# Altium schematic sheet MCU.SchDoc: Peso
size A4; ApprovedBy: Adolfo de Souza Serique; CheckedBy: Adolfo de Souza Serique; Author: Adolfo de Souza Serique; CompanyName: Agym; DrawnBy: Adolfo de Souza Serique; Engineer: Adolfo de Souza Serique; DocumentNumber: 1; Revision: 1; SheetNumber: 2; SheetTotal: 2; Size: A4
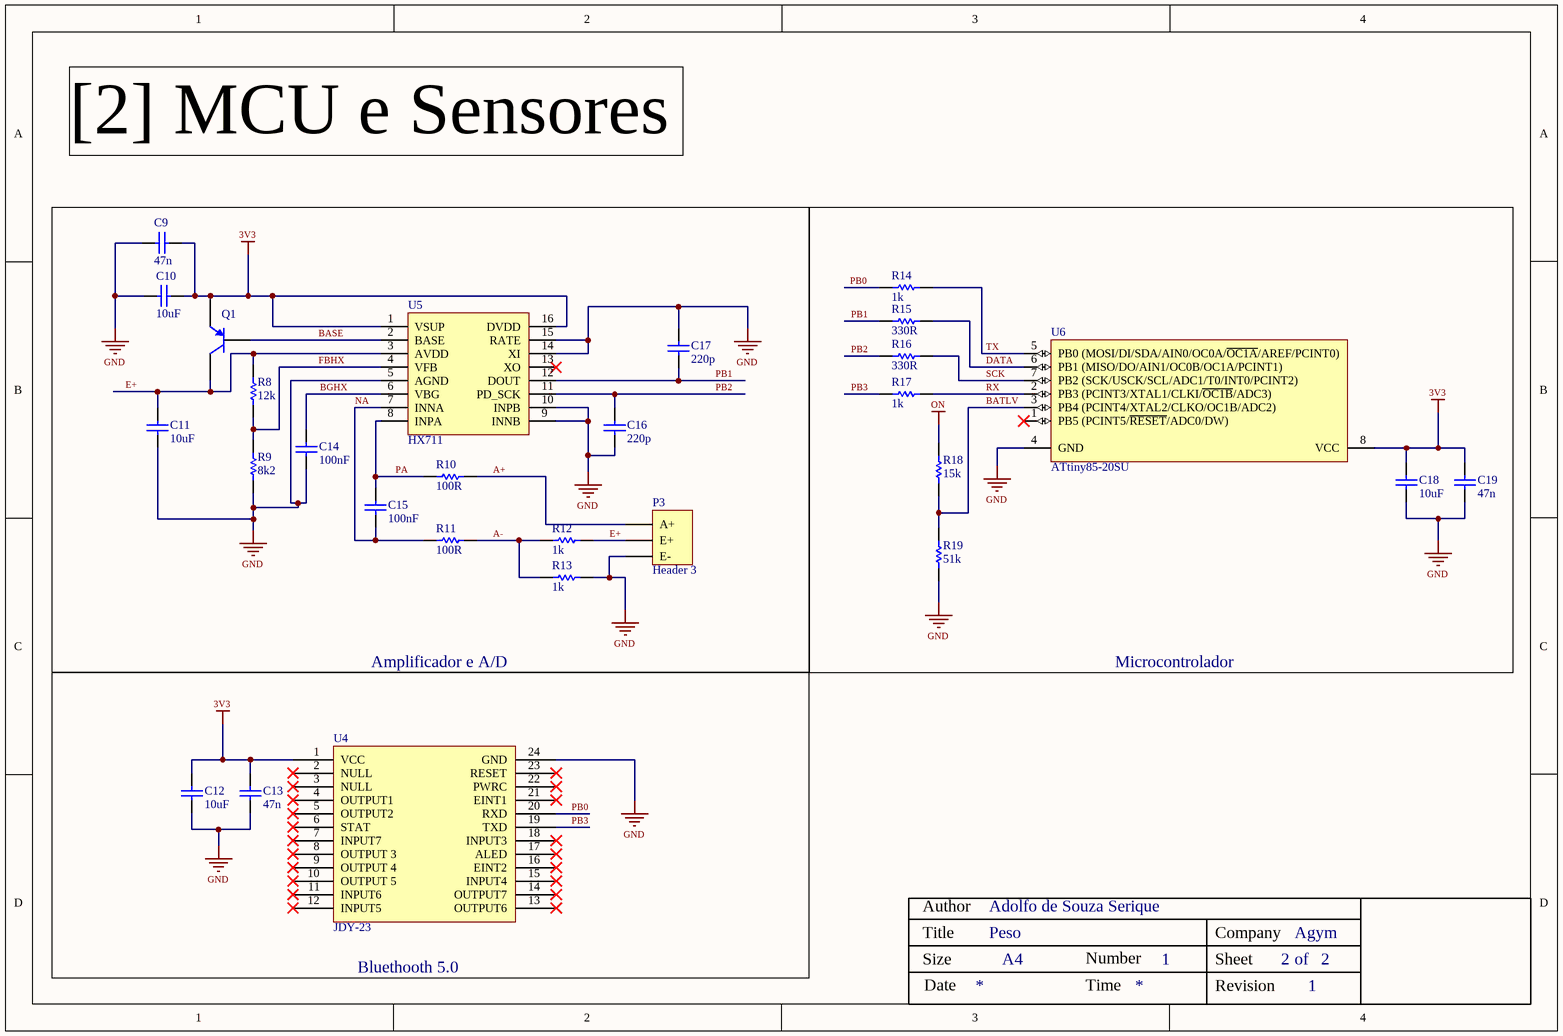
[diagram p0: MCU.SchDoc]

## Parts
C9  47n  [C1608[0603]]
C10  10uF  [C1608[0603]]
C11  10uF  [C1608[0603]]
C12  10uF  [C1608[0603]]
C13  47n  [C1608[0603]]
C14  100nF  [C1608[0603]]
C15  100nF  [C1608[0603]]
C16  220p  [C1005[0402]]
C17  220p  [C1005[0402]]
C18  10uF  [C1608[0603]]
C19  47n  [C1608[0603]]
P3  Header 3  [HDR1X3]
Q1  PNP  [SOT-23-3]  (value not drawn)
R8  12k  [R1608[0603]]
R9  8k2  [R1608[0603]]
R10  100R  [R1608[0603]]
R11  100R  [R1608[0603]]
R12  1k  [R1608[0603]]
R13  1k  [R1608[0603]]
R14  1k  [R1608[0603]]
R15  330R  [R1608[0603]]
R16  330R  [R1608[0603]]
R17  1k  [R1608[0603]]
R18  15k  [R1608[0603]]
R19  51k  [R1608[0603]]
U4  JDY-23  [JDY]
U5  HX711  [SOP-16-150mil]
U6  ATtiny85-20SU  [8S2_L]

## Blocks framed on the sheet
Microcontrolador: C18 C19 R14-R19 U6

## Nets
3V3: C9.2 C10.2 C12.1 C13.2 C18.1 C19.2 Q1.2(E) U4.1(VCC) U5.1(VSUP) U5.16(DVDD) U6.8(VCC)
GND: C9.1 C10.1 C11.1 C12.2 C13.1 C14.1 C16.1 C17.2 C18.2 C19.1 P3.2(E-) R9.1 R13.1 R19.1 U4.24(GND) U5.5(AGND) U5.9(INNB) U5.10(INPB) U5.14(XI) U5.15(RATE) U6.4(GND)
ON: R18.2
A+: P3.3(A+) R10.2
A-: R11.2 R12.1 R13.2
BASE: Q1.1(B) U5.2(BASE)
BATLV: R18.1 R19.2 U6.3(PB4_(PCINT4/XTAL2/CLKO/OC1B/ADC2))
BGHX: C14.2 U5.6(VBG)
DATA: R15.2 U6.6(PB1_(MISO/DO/AIN1/OC0B/OC1A/PCINT1))
E+: C11.2 P3.1(E+) Q1.3(C) R8.2 R12.2 U5.3(AVDD)
FBHX: R8.1 R9.2 U5.4(VFB)
NA: C15.1 R11.1 U5.7(INNA)
PA: C15.2 R10.1 U5.8(INPA)
PB0: R14.1 U4.20(RXD)
PB1: C17.1 R15.1 U5.12(DOUT)
PB2: C16.2 R16.1 U5.11(PD_SCK)
PB3: R17.1 U4.19(TXD)
RX: R17.2 U6.2(PB3_(PCINT3/XTAL1/CLKI/~{OC1B}/ADC3))
SCK: R16.2 U6.7(PB2_(SCK/USCK/SCL/ADC1/T0/INT0/PCINT2))
TX: R14.2 U6.5(PB0_(MOSI/DI/SDA/AIN0/OC0A/~{OC1A}/AREF/PCINT0))

Not connected (* = marked no-connect by the designer): U4 2(NULL)* 3(NULL)* 4(OUTPUT1)* 5(OUTPUT2)* 6(STAT)* 7(INPUT7)* 8(OUTPUT_3)* 9(OUTPUT_4)* 10(OUTPUT_5)* 11(INPUT6)* 12(INPUT5)* 13(OUTPUT6)* 14(OUTPUT7)* 15(INPUT4)* 16(EINT2)* 17(ALED)* 18(INPUT3)* 21(EINT1)* 22(PWRC)* 23(RESET)*; U5 13(XO)*; U6 1(PB5_(PCINT5/~{RESET}/ADC0/DW))*

## Notes on the sheet
- [2] MCU e Sensores
- Amplificador e A/D
- (near U4) Bluethooth 5.0
- Author
- Title
- Size
- Date
- Number
- Time
- Revision
- Sheet
- Company
- of

## Library data of the parts
C9 C13 C19 = C: Prices include import duty and tax. CAP, 0.047UF, 50V, MLCC, 0603; SVHC: No SVHC (15-Jan-2019); Manufacturer Part Number: CL10B473KB8NNNC; Value: 1; Material: Ceramic; Tolerance: 10%; Capacitance: 47nF; Dielectric: Y5V; Manufacturer: *; PartNumber: *; Package Type: *; Supplier 1: Arrow Electronics; Supplier Part Number 1: CL10B473KB8NNNC; RoHS: Yes; Category: Ceramic Capacitors; Stock 1: 896000; Pricing 1: 4000=0,00630, 8000=0,00590, 12000=0,00510, 40000=0,00420 (USD); Mount: Surface Mount; Case/Package: 0603; Case Code (Metric): 1608; Case Code (Imperial): 0603; Contact Plating: Tin; Min Operating Temperature: -55°C; Max Operating Temperature: 125°C; Voltage Rating (DC): 50V; Packaging: Tape and Reel; Voltage Rating: 50V; Package Quantity: 4000; Voltage: 50V; Series: CL; Construction: Flat; Length: 1.6mm; Width: 0.031inch; Height: 0.8mm; Thickness: 0.035inch; Depth: 0.8mm; Radiation Hardening: No; Lead Free: Lead Free; RoHS Compliant: Yes; ComponentLink1URL: https://datasheet.ciiva.com/25802/cl10b473kb8nnnc-25802915.pdf?src-supplier=Digi-Key; ComponentLink1Description: https://datasheet.ciiva.com/25802/cl10b473kb8nnnc-25802915.pdf?src-supplier=Digi-Key; ComponentLink2URL: https://datasheet.ciiva.com/15216/getdatasheetpartid-359560-15216232.pdf?src-supplier=Verical; ComponentLink2Description: https://datasheet.ciiva.com/15216/getdatasheetpartid-359560-15216232.pdf?src-supplier=Verical; ComponentLink3URL: https://datasheet.ciiva.com/29198/456947-da-01-en-vs-kondensator-0603-29198896.pdf?src-supplier=Conrad; ComponentLink3Description: https://datasheet.ciiva.com/29198/456947-da-01-en-vs-kondensator-0603-29198896.pdf?src-supplier=Conrad; ComponentLink4URL: https://datasheet.ciiva.com/26310/mlcc-catalogdownload2013-eng-26310327.pdf?src-supplier=Distrelec; ComponentLink4Description: https://datasheet.ciiva.com/26310/mlcc-catalogdownload2013-eng-26310327.pdf?src-supplier=Distrelec; LCSC Part Number: C1622
C10-C12 C18 = C: Cap Ceramic 10uF 10V X7R 20% Pad SMD 0603 125C T/R; Manufacturer Part Number: GRM188Z71A106MA73D; Manufacturer: *; PartNumber: *; Package Type: *; Value: 10uF; Supplier 1: Avnet; Supplier Part Number 1: GRM188Z71A106MA73D; RoHS: Yes; Category: Ceramic Capacitors; Stock 1: 4000; Pricing 1: 4000=0,04473, 8000=0,04347, 16000=0,04221, 24000=0,04095, 32000=0,03969 (USD); Case/Package: 0603; RoHS Compliant: Yes; LCSC Part Number: C237435
C14 C15 = C: 0603 0.1 uF 16 V ±10% Tolerance X7R Multilayer Ceramic Chip Capacitor; Manufacturer Part Number: GRM188R71C104KA01D; Value: 1; Voltage Rating: 16V; Manufacturer: *; PartNumber: *; Package Type: *; Supplier 1: Arrow Electronics; Supplier Part Number 1: GRM188R71C104KA01D; RoHS: Yes; Category: Ceramic Capacitors; Stock 1: 164000; Pricing 1: 4000=0,00650, 8000=0,00640, 20000=0,00630, 24000=0,00610 (USD); Mount: Surface Mount; Case/Package: 0603; Number of Pins: 2; Case Code (Metric): 1608; Case Code (Imperial): 0603; Material: Ceramic; Min Operating Temperature: -55°C; Max Operating Temperature: 125°C; Capacitance: 100nF; Tolerance: 10%; Dielectric: X7R; Package Quantity: 1; Packaging: Tape and Reel; Voltage Rating (DC): 16V; Termination: SMD/SMT; Voltage: 16V; Length: 1.6mm; Width: 0.031inch; Height: 0.8mm; Thickness: 0.035inch; Depth: 0.8mm; Radiation Hardening: No; REACH SVHC: No SVHC; Lead Free: Lead Free; RoHS Compliant: Yes; ComponentLink1URL: https://datasheet.ciiva.com/11786/0900766b8003061f-11786233.pdf?src-supplier=RSComponents; ComponentLink1Description: https://datasheet.ciiva.com/11786/0900766b8003061f-11786233.pdf?src-supplier=RSComponents; ComponentLink2URL: https://datasheet.ciiva.com/129/product-129808.pdf?src-supplier=Digi-Key; ComponentLink2Description: https://datasheet.ciiva.com/129/product-129808.pdf?src-supplier=Digi-Key; ComponentLink3URL: https://datasheet.ciiva.com/129/partnumbering-e-01-129807.pdf?src-supplier=Digi-Key; ComponentLink3Description: https://datasheet.ciiva.com/129/partnumbering-e-01-129807.pdf?src-supplier=Digi-Key; ComponentLink4URL: https://datasheet.ciiva.com/29202/451467-da-01-en-vs-kondensator-0603-29202287.pdf?src-supplier=Conrad; ComponentLink4Description: https://datasheet.ciiva.com/29202/451467-da-01-en-vs-kondensator-0603-29202287.pdf?src-supplier=Conrad; ComponentLink5URL: https://datasheet.ciiva.com/28534/608985-28534168.pdf?src-supplier=Element14; ComponentLink5Description: https://datasheet.ciiva.com/28534/608985-28534168.pdf?src-supplier=Element14; ComponentLink6URL: https://datasheet.ciiva.com/28659/608985-28659455.pdf?src-supplier=Element14; ComponentLink6Description: https://datasheet.ciiva.com/28659/608985-28659455.pdf?src-supplier=Element14; ComponentLink7URL: https://datasheet.ciiva.com/129/partnumbering-e-01-129809.pdf?src-supplier=Digi-Key; ComponentLink7Description: https://datasheet.ciiva.com/129/partnumbering-e-01-129809.pdf?src-supplier=Digi-Key; ComponentLink8URL: https://datasheet.ciiva.com/16199/product-16199062.pdf?src-supplier=Future+Electronics; ComponentLink8Description: https://datasheet.ciiva.com/16199/product-16199062.pdf?src-supplier=Future+Electronics; Parameter 1: *; LCSC Part Number: C45000
C16 C17 = C: CL05 Series 220 pF 50 V ±5 % Tolerance C0G SMT Multilayer Ceramic Capacitor; Manufacturer Part Number: CL05C221JB5NNNC; Value: 1; Tolerance: 5%; Capacitance: 220pF; Voltage Rating: 50V; Temperature Coefficient: 300ppm/°C; Manufacturer: *; PartNumber: *; Package Type: *; Supplier 1: Arrow Electronics; Supplier Part Number 1: CL05C221JB5NNNC; RoHS: Yes; Category: Ceramic Capacitors; Stock 1: 370000; Pricing 1: 10000=0,00530, 20000=0,00490, 30000=0,00450, 50000=0,00430, 100000=0,00360 (USD); Mount: Surface Mount; Case/Package: 0402; Case Code (Metric): 1005; Case Code (Imperial): 0402; Contact Plating: Tin; Min Operating Temperature: -55°C; Max Operating Temperature: 125°C; Packaging: Tape and Reel; Package Quantity: 1; Dielectric: C0G; Voltage: 50V; Voltage Rating (DC): 50V; Series: CL; Construction: Flat; Length: 1mm; Width: 0.02inch; Height: 0.5mm; Thickness: 0.022inch; Depth: 0.5mm; Radiation Hardening: No; Lead Free: Lead Free; RoHS Compliant: Yes; ComponentLink1URL: https://datasheet.ciiva.com/25742/cl05c221jb5nnnc-25742469.pdf?src-supplier=Digi-Key; ComponentLink1Description: https://datasheet.ciiva.com/25742/cl05c221jb5nnnc-25742469.pdf?src-supplier=Digi-Key; ComponentLink2URL: https://datasheet.ciiva.com/26838/getdatasheetpartid-650891-26838293.pdf?src-supplier=Verical; ComponentLink2Description: https://datasheet.ciiva.com/26838/getdatasheetpartid-650891-26838293.pdf?src-supplier=Verical; ComponentLink3URL: https://datasheet.ciiva.com/25665/clseries-25665771.pdf?src-supplier=Future+Electronics; ComponentLink3Description: https://datasheet.ciiva.com/25665/clseries-25665771.pdf?src-supplier=Future+Electronics; LCSC Part Number: C307445
P3 = Header 3: Header, 3-Pin; LatestRevisionDate: 17-Jul-2002; LatestRevisionNote: Re-released for DXP Platform.; Publisher: Altium Limited
Q1 = S8550-2TY: Transistor Bipolar SOT-23 25V 300mW 500mA PNP; Manufacturer: Jiangsu Changjing Electronics Technology Co., Ltd.; Manufacturer Part Number: S8550-2TY; Supplier Part Number 1: S8550-2TY; LCSC Part Number: C2147
R8 = R: Res Thick Film 0603 12K Ohm 0.5% 1/16W ±50ppm/°C Molded SMD Punched Carrier T/R; Manufacturer Part Number: ERJ3RBD1202V; Value: 0; Resistance: 12kR; Power Rating: 100mW; Voltage Rating: 50V; Manufacturer: *; PartNumber: *; Package Type: *; Supplier 1: RSComponents; Supplier Part Number 1: 8102126; RoHS: Yes; Category: Chip SMD Resistors; Stock 1: 2700; Pricing 1: 100=0,05100, 500=0,04700, 1000=0,04400, 2500=0,04100, 5000=0,03800 (GBP); Mount: Surface Mount; Case/Package: 0603; Case Code (Metric): 1608; Case Code (Imperial): 0603; Contact Plating: Tin; Min Operating Temperature: -55°C; Max Operating Temperature: 125°C; Tolerance: 0.5%; Packaging: Cut Tape; Resistor Type: Thick Film; Termination: Solder; Temperature Coefficient: 50ppm/°C; Voltage Rating (DC): 50V; Resistance Tolerance: 0.5%; Technology: THICK FILM; Length: 1.6mm; Height: 0.45mm; Depth: 0.8mm; REACH SVHC: No SVHC; ComponentLink1URL: https://datasheet.ciiva.com/28688/1678782-28688533.pdf?src-supplier=Element14; ComponentLink1Description: https://datasheet.ciiva.com/28688/1678782-28688533.pdf?src-supplier=Element14; LCSC Part Number: C336849
R9 = R: Resistor; Manufacturer: PANASONIC; Manufacturer Part Number: ERA3VEB8201V; Value: 8k2R; Package Type: 0603; Supplier Part Number 1: ERA3VEB8201V; LCSC Part Number: C543696
R10 R11 = R: Res Thin Film 0603 100 Ohm 0.1% 1/10W ±25ppm/°C Molded SMD SMD Punched Carrier T/R; Manufacturer Part Number: ERA-3AEB101V; Value: 0; Power Rating: 100mW; Voltage Rating: 75V; Manufacturer: *; PartNumber: *; Package Type: *; Supplier 1: RSComponents; Supplier Part Number 1: 0566535; RoHS: Yes; Category: Chip SMD Resistors; Stock 1: 720; Pricing 1: 5=0,39000, 50=0,36200, 100=0,33800, 250=0,31600, 500=0,28800 (GBP); Mount: Surface Mount; Case/Package: 0603; Number of Pins: 2; Contact Plating: Tin; Case Code (Metric): 1608; Case Code (Imperial): 0603; Size Code: 0603; Min Operating Temperature: -55°C; Max Operating Temperature: 155°C; Tolerance: 0.1%; Resistance: 100R; Resistor Type: Thin Film; Temperature Coefficient: 25ppm/°C; Packaging: Tape and Reel; Package Quantity: 5000; Number of Terminations: 2; Termination: SMD/SMT; Max Power Dissipation: 100mW; Series: ERA-3A; Construction: Rectangular; Resistance Tolerance: 0.1%; Technology: METAL FILM; Length: 1.6mm; Width: 0.8mm; Height: 0.45mm; Depth: 0.8mm; Radiation Hardening: No; REACH SVHC: No SVHC; Military Standard: Not; RoHS Compliant: Yes; ComponentLink1URL: https://datasheet.ciiva.com/11808/0900766b80fe20f7-11808029.pdf?src-supplier=RSComponents; ComponentLink1Description: https://datasheet.ciiva.com/11808/0900766b80fe20f7-11808029.pdf?src-supplier=RSComponents; ComponentLink2URL: https://datasheet.ciiva.com/29183/450355-da-01-en-widerstand-0603-era-29183658.pdf?src-supplier=Conrad; ComponentLink2Description: https://datasheet.ciiva.com/29183/450355-da-01-en-widerstand-0603-era-29183658.pdf?src-supplier=Conrad; ComponentLink3URL: https://datasheet.ciiva.com/46422/485442-46422518.pdf?src-supplier=Element14; ComponentLink3Description: https://datasheet.ciiva.com/46422/485442-46422518.pdf?src-supplier=Element14; ComponentLink4URL: https://datasheet.ciiva.com/5734/485442-5734520.pdf?src-supplier=Farnell; ComponentLink4Description: https://datasheet.ciiva.com/5734/485442-5734520.pdf?src-supplier=Farnell; ComponentLink5URL: https://datasheet.ciiva.com/46422/485442-46422517.pdf?src-supplier=Element14; ComponentLink5Description: https://datasheet.ciiva.com/46422/485442-46422517.pdf?src-supplier=Element14; ComponentLink6URL: https://datasheet.ciiva.com/48425/era-eng-tds-48425407.pdf?src-supplier=Distrelec; ComponentLink6Description: https://datasheet.ciiva.com/48425/era-eng-tds-48425407.pdf?src-supplier=Distrelec; ComponentLink7URL: https://datasheet.ciiva.com/7830/485442-7830582.pdf?src-supplier=Element14; ComponentLink7Description: https://datasheet.ciiva.com/7830/485442-7830582.pdf?src-supplier=Element14; ComponentLink8URL: https://datasheet.ciiva.com/5734/485442-5734521.pdf?src-supplier=Farnell; ComponentLink8Description: https://datasheet.ciiva.com/5734/485442-5734521.pdf?src-supplier=Farnell; ComponentLink9URL: https://datasheet.ciiva.com/28513/39837-28513817.pdf?src-supplier=Element14; ComponentLink9Description: https://datasheet.ciiva.com/28513/39837-28513817.pdf?src-supplier=Element14; ComponentLink10URL: https://datasheet.ciiva.com/16725/70068849-16725037.pdf?src-supplier=Allied+Electronics; ComponentLink10Description: https://datasheet.ciiva.com/16725/70068849-16725037.pdf?src-supplier=Allied+Electronics; ComponentLink11URL: https://datasheet.ciiva.com/9186/aoa0000ce26-9186735.pdf?src-supplier=Avnet; ComponentLink11Description: https://datasheet.ciiva.com/9186/aoa0000ce26-9186735.pdf?src-supplier=Avnet; ComponentLink12URL: https://datasheet.ciiva.com/45928/54aoa0000ce26-45928637.pdf?src-supplier=Onlinecomponents.com; ComponentLink12Description: https://datasheet.ciiva.com/45928/54aoa0000ce26-45928637.pdf?src-supplier=Onlinecomponents.com; LCSC Part Number: C445624
R12-R14 R17 = R: ERJ Series 0603 1 kOhm 0.2 W ±0.1 % ±50ppm/°C Thick Film Chip Resistor; Manufacturer Part Number: ERJ-PB3B1001V; Value: 0; Resistance: 1kR; Tolerance: 0.1%; Max Power Dissipation: 200mW; Manufacturer: *; PartNumber: *; Package Type: *; Supplier 1: Arrow Electronics; Supplier Part Number 1: ERJ-PB3B1001V; RoHS: Yes; Category: Chip SMD Resistors; Stock 1: 430; Pricing 1: 1=0,24170, 10=0,17640, 25=0,13980, 100=0,08630, 250=0,06400 (USD); Case/Package: 0603; Case Code (Metric): 1608; Case Code (Imperial): 0603; Min Operating Temperature: -55°C; Max Operating Temperature: 155°C; Packaging: Tape and Reel; Resistor Type: Thick Film; Number of Terminations: 2; Temperature Coefficient: 50ppm/°C; Features: Automotive AEC-Q200; Length: 0.063inch; Width: 0.032inch; Height - Seated (Max): 0.022inch; ComponentLink1URL: https://industrial.panasonic.com/sa/system/files/data/download/catalog/id_fixed-resistors_e_2.pdf?src-supplier=Digi-Key; ComponentLink1Description: https://industrial.panasonic.com/sa/system/files/data/download/catalog/id_fixed-resistors_e_2.pdf?src-supplier=Digi-Key; ComponentLink2URL: https://industrial.panasonic.com/cdbs/www-data/pdf/RDM0000/DMM0000COL5.pdf?src-supplier=Digi-Key; ComponentLink2Description: https://industrial.panasonic.com/cdbs/www-data/pdf/RDM0000/DMM0000COL5.pdf?src-supplier=Digi-Key; ComponentLink3URL: http://www.farnell.com/datasheets/2883953.pdf?src-supplier=Newark; ComponentLink3Description: http://www.farnell.com/datasheets/2883953.pdf?src-supplier=Newark; LCSC Part Number: C193680
R15 R16 = R: Res Thick Film 0603 330 Ohm 1% 1/10W +/-100ppm/ßC Molded SMD Punched Carrier T/R; Manufacturer Part Number: ERJ3EKF3300V; Value: 0; Power Rating: 100mW; Voltage Rating: 75V; Temperature Coefficient: 100ppm/°C; Manufacturer: *; PartNumber: *; Package Type: *; Supplier 1: Arrow Electronics; Supplier Part Number 1: ERJ-3EKF3300V; RoHS: Yes; Category: Chip SMD Resistors; Stock 1: 28687; Pricing 1: 1=0,05610, 10=0,04460, 25=0,03990, 100=0,01680, 250=0,01580, 500=0,01570, 1000=0,00850, 3000=0,00790, 6000=0,00550 (USD); Mount: Surface Mount; Case/Package: 0603; Number of Pins: 2; Case Code (Imperial): 0603; Case Code (Metric): 1608; Weight: 7.1E-05oz; Contact Plating: Tin; Size Code: 0603; Min Operating Temperature: -55°C; Max Operating Temperature: 155°C; Tolerance: 1%; Resistance: 330R; Packaging: Tape and Reel; Package Quantity: 5000; Resistor Type: Thick Film; Termination: SMD/SMT; Number of Terminations: 2; Max Power Dissipation: 100mW; Voltage Rating (DC): 75V; Features: Automotive AEC-Q200; Series: ERJ; Resistance Tolerance: 1%; Construction: Rectangular; Length: 1.6mm; Width: 0.8mm; Height: 0.45mm; Depth: 0.8mm; Radiation Hardening: No; REACH SVHC: No SVHC; Military Standard: Not; Lead Free: Lead Free; RoHS Compliant: Yes; ComponentLink1URL: https://datasheet.ciiva.com/7886/aoa0000ce2-7886729.pdf?src-supplier=Element14; ComponentLink1Description: https://datasheet.ciiva.com/7886/aoa0000ce2-7886729.pdf?src-supplier=Element14; ComponentLink2URL: https://datasheet.ciiva.com/46373/1678782-46373899.pdf?src-supplier=Element14; ComponentLink2Description: https://datasheet.ciiva.com/46373/1678782-46373899.pdf?src-supplier=Element14; ComponentLink3URL: https://datasheet.ciiva.com/22721/426256-22721099.pdf?src-supplier=Element14; ComponentLink3Description: https://datasheet.ciiva.com/22721/426256-22721099.pdf?src-supplier=Element14; ComponentLink4URL: https://datasheet.ciiva.com/46373/1678782-46373900.pdf?src-supplier=Element14; ComponentLink4Description: https://datasheet.ciiva.com/46373/1678782-46373900.pdf?src-supplier=Element14; ComponentLink5URL: https://datasheet.ciiva.com/9117/aoa0000ce2-9117132.pdf?src-supplier=Avnet; ComponentLink5Description: https://datasheet.ciiva.com/9117/aoa0000ce2-9117132.pdf?src-supplier=Avnet; ComponentLink6URL: https://datasheet.ciiva.com/48531/aoa0000ce2-48531001.pdf?src-supplier=Avnet; ComponentLink6Description: https://datasheet.ciiva.com/48531/aoa0000ce2-48531001.pdf?src-supplier=Avnet; LCSC Part Number: C278617
R18 = R: Res Thick Film 0603 15K Ohm 1% 1/10W ±100ppm/°C SMD Punched Carrier T/R; Manufacturer Part Number: ERJ-3EKF1502V; Value: 0; Resistance: 15kR; Power Rating: 100mW; Voltage Rating: 75V; Manufacturer: *; PartNumber: *; Package Type: *; Supplier 1: Arrow Electronics; Supplier Part Number 1: ERJ-3EKF1502V; RoHS: Yes; Category: Chip SMD Resistors; Stock 1: 40000; Pricing 1: 5000=0,00980, 10000=0,00660, 25000=0,00490, 50000=0,00370, 125000=0,00360 (USD); Mount: Surface Mount; Case/Package: 0603; Number of Pins: 2; Contact Plating: Tin; Case Code (Metric): 1608; Case Code (Imperial): 0603; Min Operating Temperature: -55°C; Max Operating Temperature: 155°C; Tolerance: 1%; Resistor Type: Thick Film; Temperature Coefficient: 100ppm/°C; Packaging: Tape and Reel; Package Quantity: 1; Number of Terminations: 2; Termination: SMD/SMT; Max Power Dissipation: 100mW; Voltage Rating (DC): 75V; Features: Automotive AEC-Q200; Series: ERJ; Construction: Rectangular; Resistance Tolerance: 1%; Length: 1.6mm; Width: 0.031inch; Height: 0.022inch; Depth: 0.8mm; Radiation Hardening: No; REACH SVHC: No SVHC; Military Standard: Not; Lead Free: Lead Free; RoHS Compliant: Yes; ComponentLink1URL: https://datasheet.ciiva.com/6138/aoa0000ce2-6138183.pdf?src-supplier=Farnell; ComponentLink1Description: https://datasheet.ciiva.com/6138/aoa0000ce2-6138183.pdf?src-supplier=Farnell; ComponentLink2URL: https://datasheet.ciiva.com/7830/aoa0000ce2-7830732.pdf?src-supplier=Element14; ComponentLink2Description: https://datasheet.ciiva.com/7830/aoa0000ce2-7830732.pdf?src-supplier=Element14; ComponentLink3URL: https://datasheet.ciiva.com/7830/426256-7830982.pdf?src-supplier=Element14; ComponentLink3Description: https://datasheet.ciiva.com/7830/426256-7830982.pdf?src-supplier=Element14; ComponentLink4URL: https://datasheet.ciiva.com/46372/1678782-46372846.pdf?src-supplier=Element14; ComponentLink4Description: https://datasheet.ciiva.com/46372/1678782-46372846.pdf?src-supplier=Element14; ComponentLink5URL: https://datasheet.ciiva.com/22722/426256-22722779.pdf?src-supplier=Element14; ComponentLink5Description: https://datasheet.ciiva.com/22722/426256-22722779.pdf?src-supplier=Element14; ComponentLink6URL: https://datasheet.ciiva.com/46372/1678782-46372847.pdf?src-supplier=Element14; ComponentLink6Description: https://datasheet.ciiva.com/46372/1678782-46372847.pdf?src-supplier=Element14; ComponentLink7URL: https://datasheet.ciiva.com/24026/aoa0000ce2-24026054.pdf?src-supplier=Mouser; ComponentLink7Description: https://datasheet.ciiva.com/24026/aoa0000ce2-24026054.pdf?src-supplier=Mouser; ComponentLink8URL: https://datasheet.ciiva.com/16770/70260748-16770997.pdf?src-supplier=Allied+Electronics; ComponentLink8Description: https://datasheet.ciiva.com/16770/70260748-16770997.pdf?src-supplier=Allied+Electronics; ComponentLink9URL: https://datasheet.ciiva.com/16762/70260748-16762729.pdf?src-supplier=Allied+Electronics; ComponentLink9Description: https://datasheet.ciiva.com/16762/70260748-16762729.pdf?src-supplier=Allied+Electronics; ComponentLink10URL: https://datasheet.ciiva.com/9193/aoa0000ce2-9193001.pdf?src-supplier=Avnet; ComponentLink10Description: https://datasheet.ciiva.com/9193/aoa0000ce2-9193001.pdf?src-supplier=Avnet; ComponentLink11URL: https://datasheet.ciiva.com/48530/aoa0000ce2-48530983.pdf?src-supplier=Avnet; ComponentLink11Description: https://datasheet.ciiva.com/48530/aoa0000ce2-48530983.pdf?src-supplier=Avnet; LCSC Part Number: C192164
R19 = R: Res Thick Film 0603 51K Ohm 1% 1/10W ±100ppm/°C Molded SMD Punched Carrier T/R; Manufacturer Part Number: ERJ-3EKF5102V; Value: 0; Resistance: 51kR; Power Rating: 100mW; Voltage Rating: 75V; Manufacturer: *; PartNumber: *; Package Type: *; Supplier 1: Arrow Electronics; Supplier Part Number 1: ERJ-3EKF5102V; RoHS: Yes; Category: Chip SMD Resistors; Stock 1: 31209; Pricing 1: 1=0,07430, 10=0,04440, 25=0,03220, 100=0,01960, 250=0,01410, 500=0,01220, 1000=0,00710, 3000=0,00650, 6000=0,00570, 15000=0,00490, 30000=0,00460 (USD); Mount: Surface Mount; Case/Package: 0603; Case Code (Metric): 1608; Case Code (Imperial): 0603; Contact Plating: Tin; Min Operating Temperature: -55°C; Max Operating Temperature: 155°C; Tolerance: 1%; Packaging: Tape and Reel; Package Quantity: 1; Resistor Type: Thick Film; Number of Terminations: 2; Termination: SMD/SMT; Temperature Coefficient: 100ppm/°C; Max Power Dissipation: 100mW; Voltage Rating (DC): 75V; Features: Automotive AEC-Q200; Series: ERJ; Construction: Rectangular; Resistance Tolerance: 1%; Length: 1.6mm; Width: 0.031inch; Height: 0.022inch; Depth: 0.8mm; Radiation Hardening: No; REACH SVHC: No SVHC; Military Standard: Not; Lead Free: Lead Free; RoHS Compliant: Yes; ComponentLink1URL: https://datasheet.ciiva.com/43460/426256-43460598.pdf?src-supplier=Farnell; ComponentLink1Description: https://datasheet.ciiva.com/43460/426256-43460598.pdf?src-supplier=Farnell; ComponentLink2URL: https://datasheet.ciiva.com/46386/426256-46386760.pdf?src-supplier=Element14; ComponentLink2Description: https://datasheet.ciiva.com/46386/426256-46386760.pdf?src-supplier=Element14; ComponentLink3URL: https://datasheet.ciiva.com/5917/426256-5917832.pdf?src-supplier=Farnell; ComponentLink3Description: https://datasheet.ciiva.com/5917/426256-5917832.pdf?src-supplier=Farnell; ComponentLink4URL: https://datasheet.ciiva.com/46374/426256-46374009.pdf?src-supplier=Element14; ComponentLink4Description: https://datasheet.ciiva.com/46374/426256-46374009.pdf?src-supplier=Element14; ComponentLink5URL: https://datasheet.ciiva.com/28565/1678782-28565131.pdf?src-supplier=Element14; ComponentLink5Description: https://datasheet.ciiva.com/28565/1678782-28565131.pdf?src-supplier=Element14; ComponentLink6URL: https://datasheet.ciiva.com/16786/70260748-16786782.pdf?src-supplier=Allied+Electronics; ComponentLink6Description: https://datasheet.ciiva.com/16786/70260748-16786782.pdf?src-supplier=Allied+Electronics; ComponentLink7URL: https://datasheet.ciiva.com/16761/70260748-16761518.pdf?src-supplier=Allied+Electronics; ComponentLink7Description: https://datasheet.ciiva.com/16761/70260748-16761518.pdf?src-supplier=Allied+Electronics; ComponentLink8URL: https://datasheet.ciiva.com/9117/aoa0000ce2-9117143.pdf?src-supplier=Avnet; ComponentLink8Description: https://datasheet.ciiva.com/9117/aoa0000ce2-9117143.pdf?src-supplier=Avnet; LCSC Part Number: C169254
U4 = JDY-23: BD Module
U5 = HX711: Amplificador e A/D; Manufacturer: Avia Semicon (Xiamen); Manufacturer Part Number: HX711; Supplier Part Number 1: HX711; LCSC Part Number: C43656
U6 = ATtiny85-20SU: 8-bit AVR Microcontroller, 20MHz, 2.7-5.5V, 8K Flash, 512 Bytes EEPROM, 512 Bytes SRAM, Industrial Grade (-40°C to 85°C), 8-Lead SOIC, Pb-Free; DatasheetVersion: revN, Apr-2011; PackageVersion: revF, Apr-2008; PackageReference: 8S2; PackageDescription: 8-Lead, 0.208" Body, Plastic Small Outline Package (EIAJ); ComponentLink1Description: Manufacturer URL; ComponentLink1URL: http://www.atmel.com/; ComponentLink2Description: ATtiny25/45/85 Datasheet; ComponentLink2URL: http://www.atmel.com/dyn/resources/prod_documents/doc2586.pdf; ComponentLink3Description: ATtiny25/45/85 Summary; ComponentLink3URL: http://www.atmel.com/dyn/resources/prod_documents/2586S.pdf